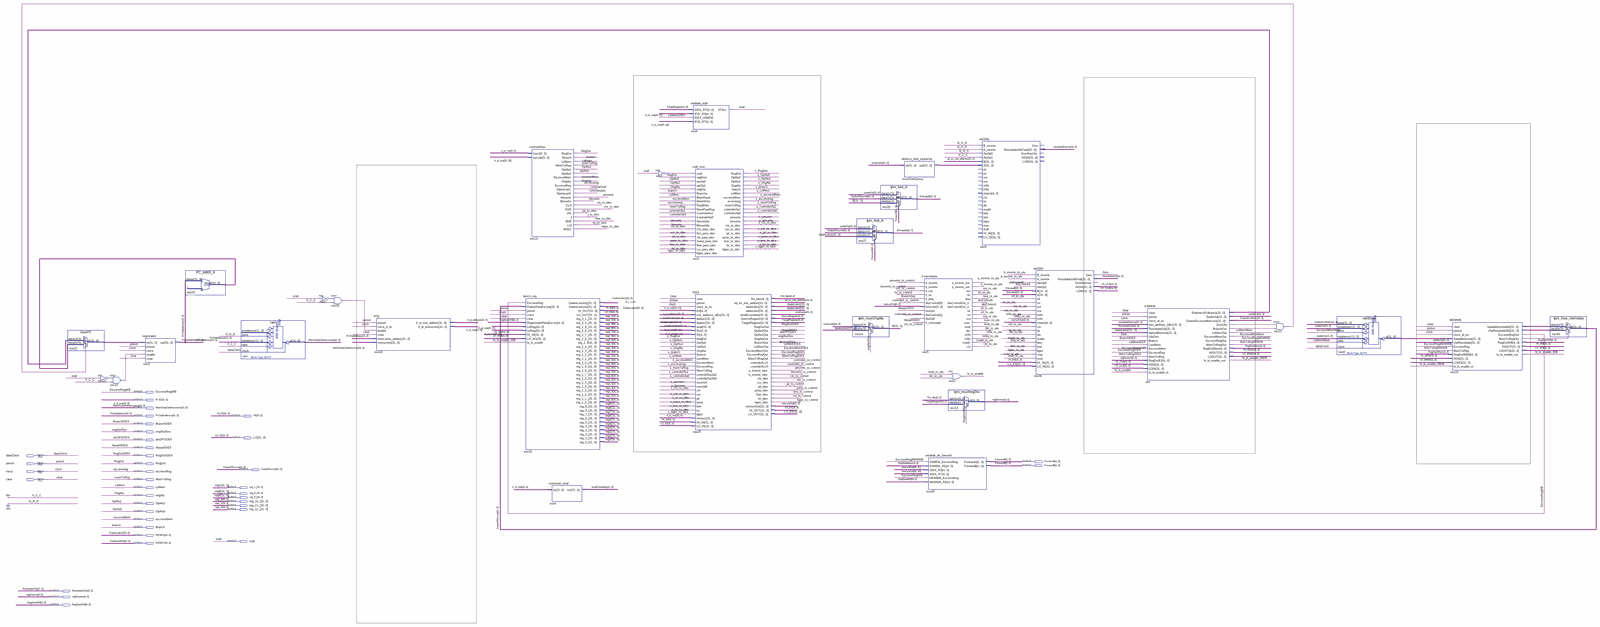
[diagram p0: schematic sheet, whole]
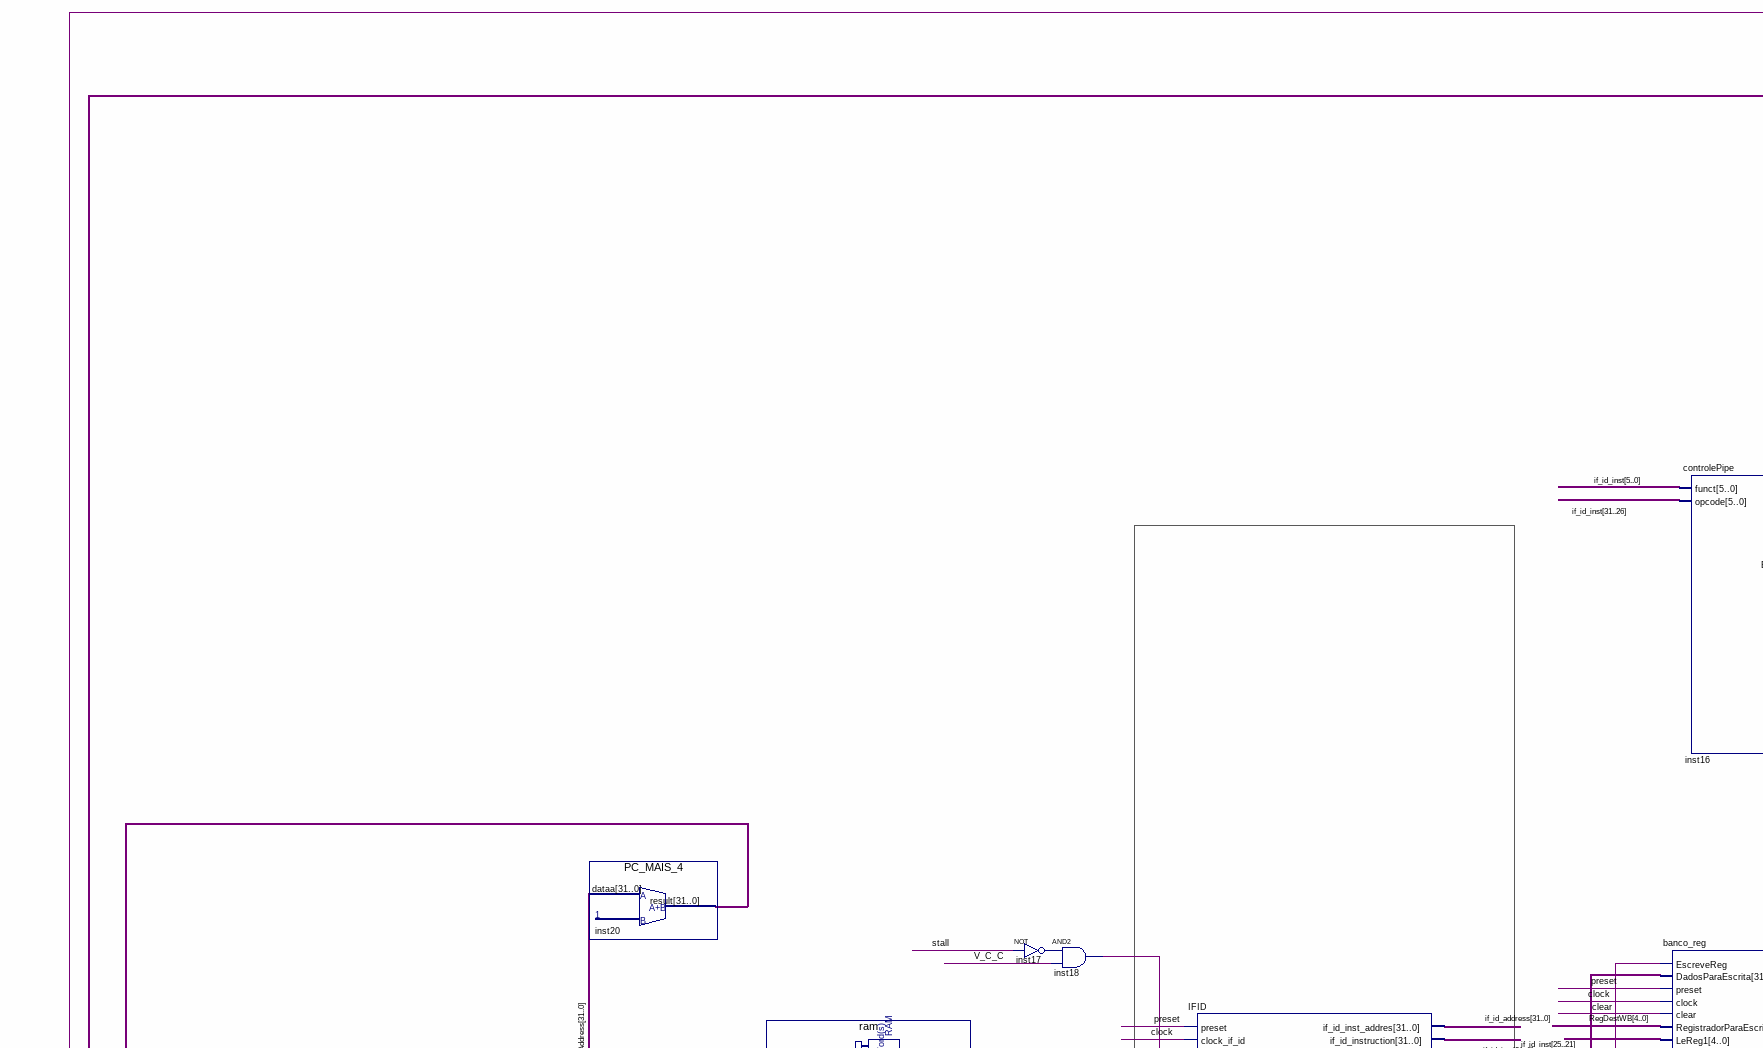
[diagram p1: schematic sheet, upper left part]
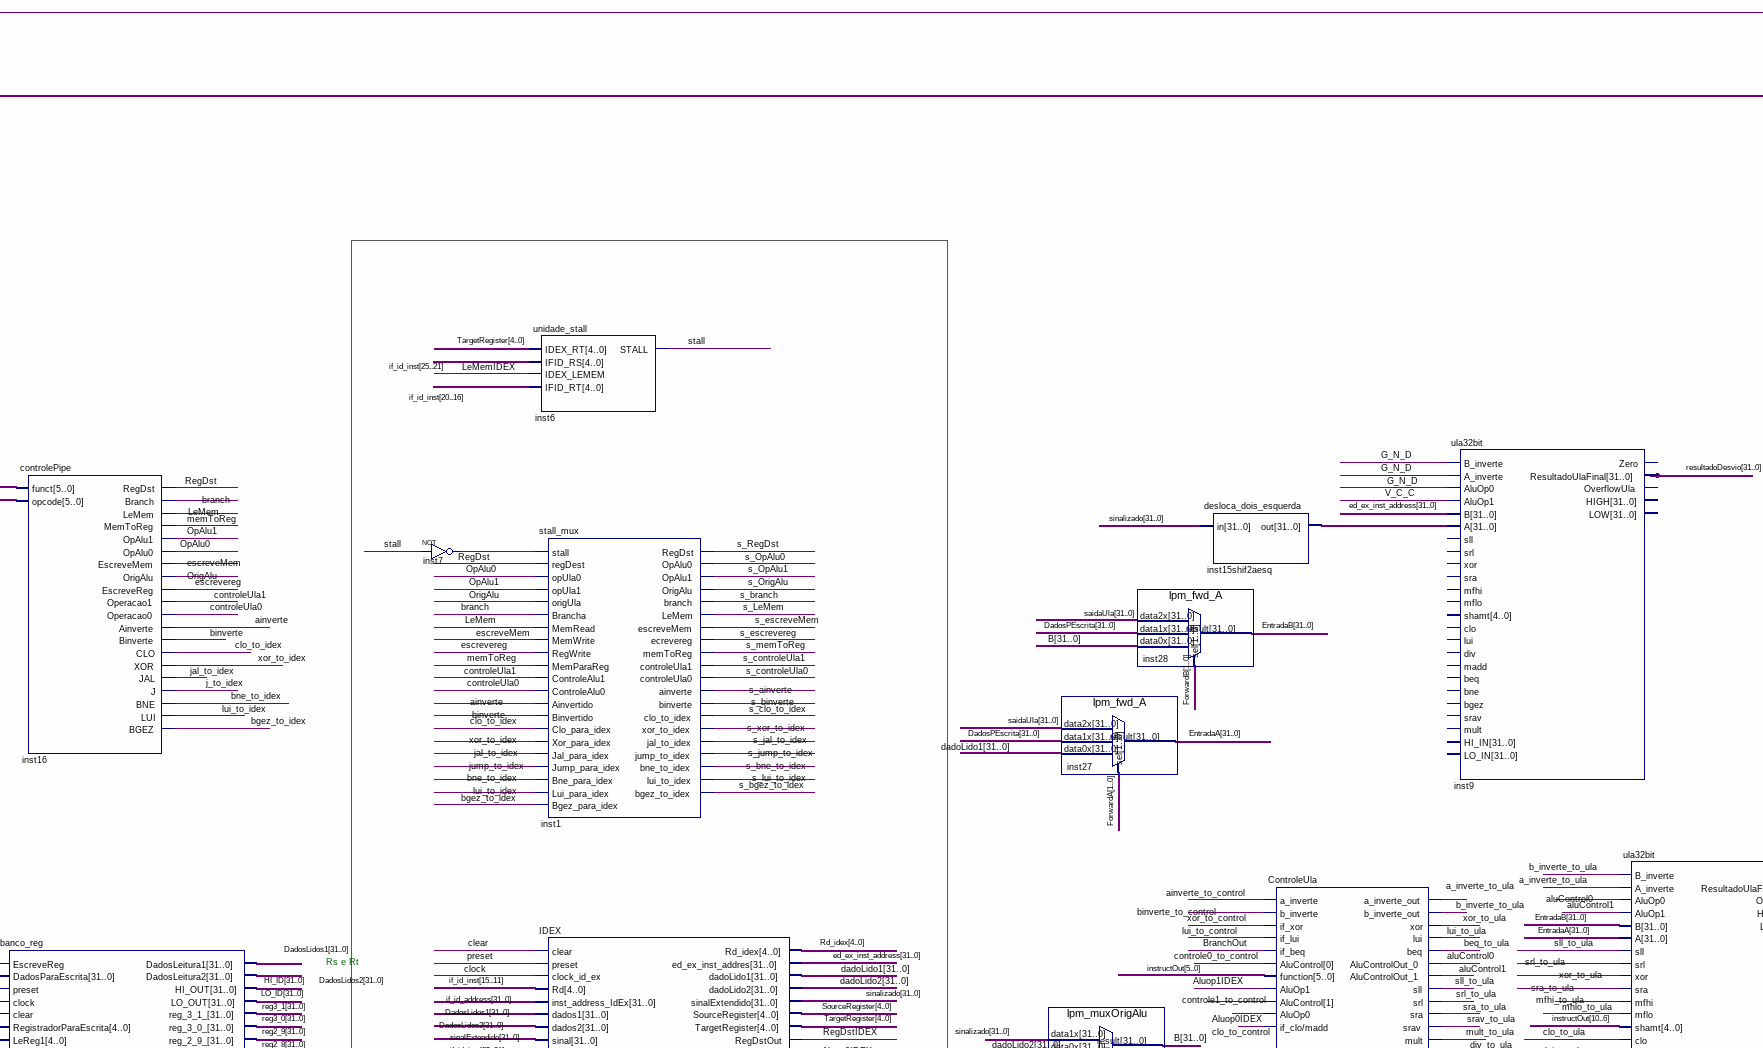
[diagram p2: schematic sheet, upper centre part]
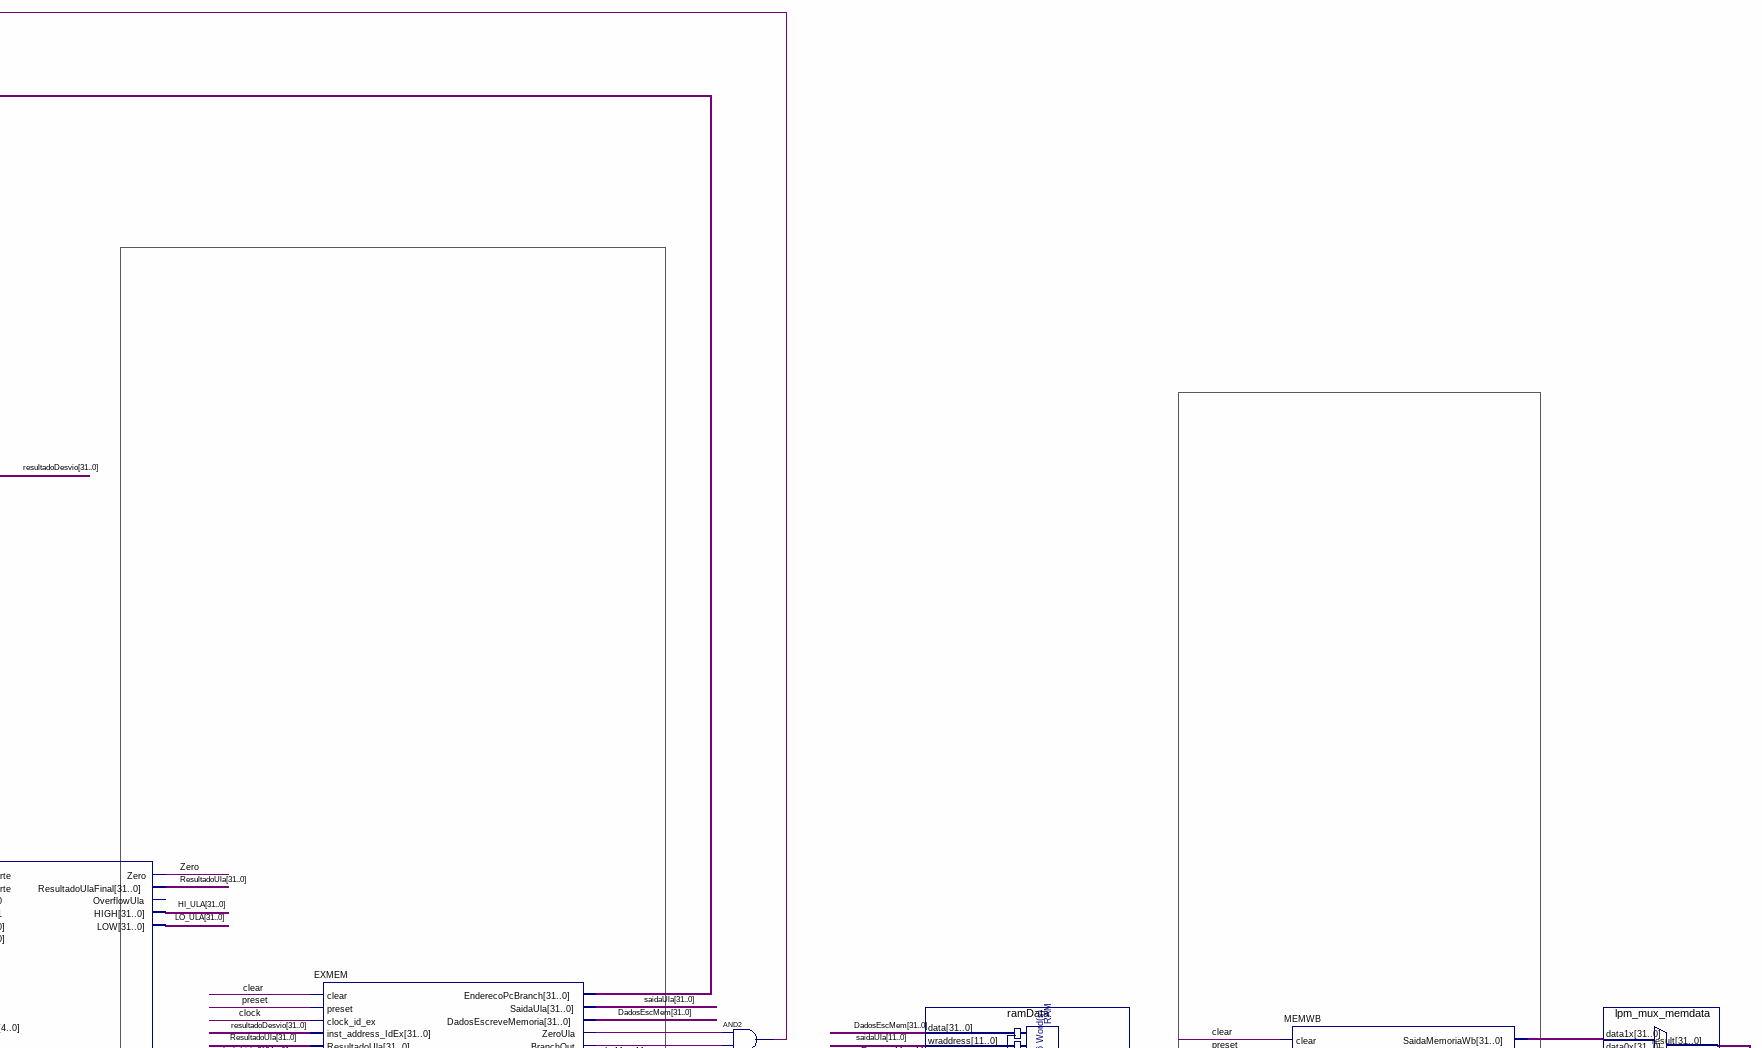
[diagram p3: schematic sheet, upper right part]
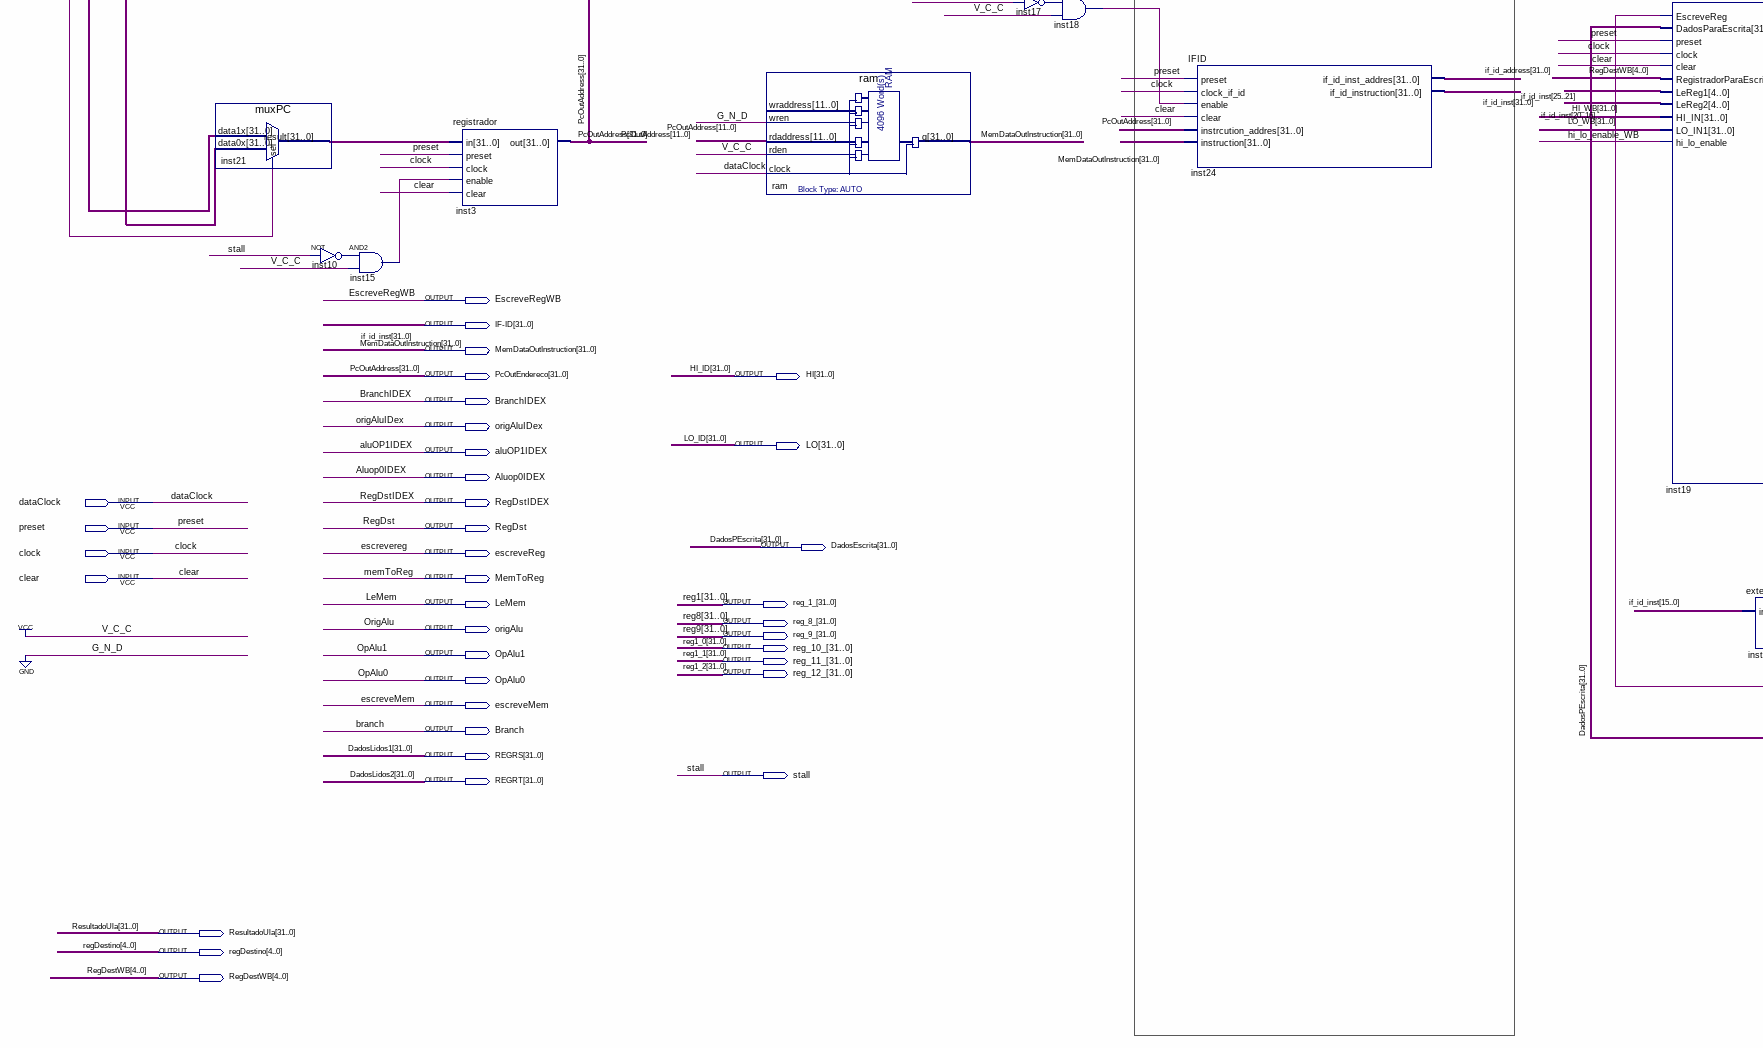
[diagram p4: schematic sheet, lower left part]
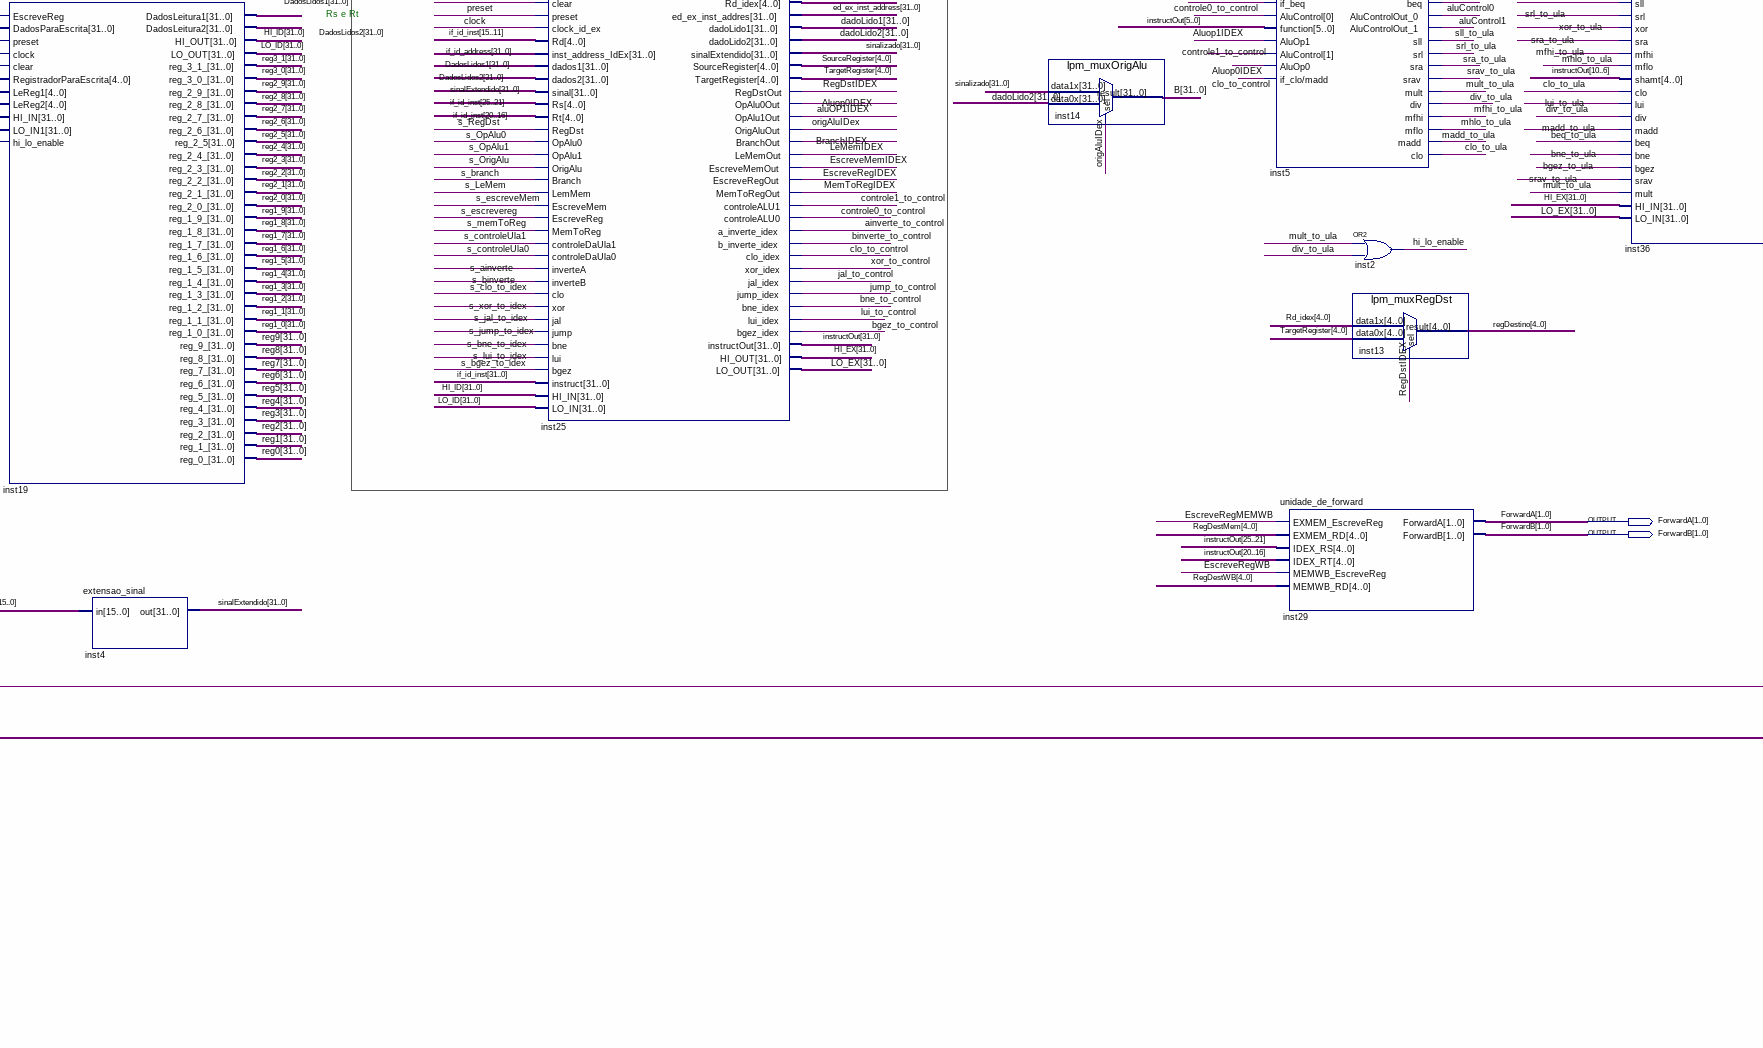
[diagram p5: schematic sheet, lower centre part]
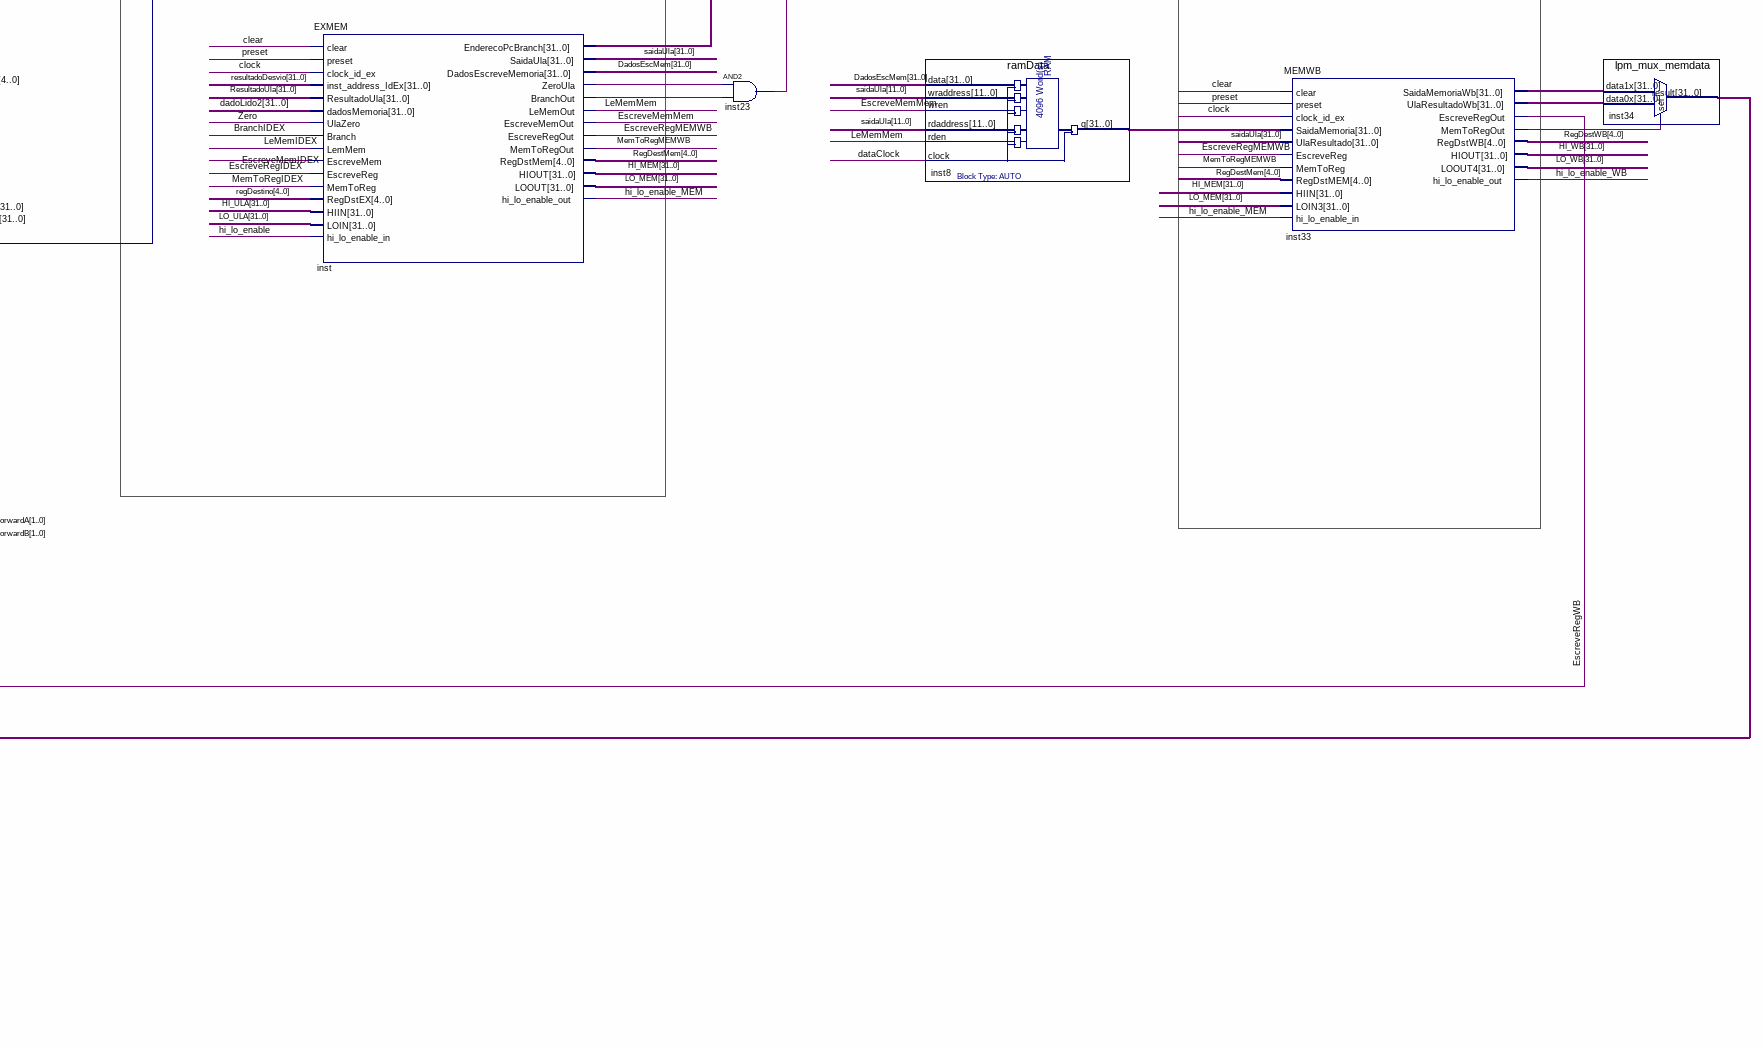
[diagram p6: schematic sheet, lower right part]
// Quartus schematic MipsProcessador.bdf as structural Verilog: 31 symbols, 39 pins
module MipsProcessador (
  input  dataClock,
  input  preset,
  input  clock,
  input  clear,
  output EscreveRegWB,
  output [31:0] \IF-ID ,
  output [31:0] MemDataOutInstruction,
  output [31:0] PcOutEndereco,
  output [31:0] HI,
  output BranchIDEX,
  output origAluIDex,
  output [31:0] LO,
  output aluOP1IDEX,
  output Aluop0IDEX,
  output RegDstIDEX,
  output [1:0] ForwardA,
  output RegDst,
  output [1:0] ForwardB,
  output [31:0] DadosEscrita,
  output escreveReg,
  output MemToReg,
  output LeMem,
  output [31:0] reg_1_,
  output [31:0] reg_8_,
  output origAlu,
  output [31:0] reg_9_,
  output [31:0] reg_10_,
  output OpAlu1,
  output [31:0] reg_11_,
  output [31:0] reg_12_,
  output OpAlu0,
  output escreveMem,
  output Branch,
  output [31:0] REGRS,
  output stall,
  output [31:0] REGRT,
  output [31:0] ResultadoUla,
  output [4:0] regDestino,
  output [4:0] RegDestWB
);

  wire a_inverte_to_ula, ainverte, ainverte_to_control, aluControl0, aluControl1, b_inverte_to_ula,
       beq_to_ula, bgez_to_control, bgez_to_idex, bgez_to_ula, binverte, binverte_to_control, bne_to_control,
       bne_to_idex, bne_to_ula, BranchOut, clo_to_control, clo_to_idex, clo_to_ula, controle0_to_control,
       controle1_to_control, controleUla0, controleUla1, div_to_ula, EscreveMemIDEX, EscreveMemMem,
       EscreveRegIDEX, EscreveRegMEMWB, hi_lo_enable, hi_lo_enable_MEM, hi_lo_enable_WB, inst7_out,
       inst10_out, inst15_out, inst17_out, inst18_out, inst23_out, inst33_memtoregout, inst_branchout,
       inst_zeroula, j_to_idex, jal_to_control, jal_to_idex, jump_to_control, jump_to_idex, LeMemIDEX,
       LeMemMem, lui_to_control, lui_to_idex, lui_to_ula, madd_to_ula, MemToRegIDEX, MemToRegMEMWB,
       mfhi_to_ula, mhlo_to_ula, mult_to_ula, s_ainverte, s_bgez_to_idex, s_binverte, s_bne_to_idex,
       s_branch, s_clo_to_idex, s_controleUla0, s_controleUla1, s_escreveMem, s_escrevereg, s_jal_to_idex,
       s_jump_to_idex, s_LeMem, s_lui_to_idex, s_memToReg, s_OpAlu0, s_OpAlu1, s_OrigAlu, s_RegDst,
       s_xor_to_idex, sll_to_ula, sra_to_ula, srav_to_ula, srl_to_ula, xor_to_control, xor_to_idex,
       xor_to_ula, Zero;
  wire [4:0] Rd_idex, RegDestMem, SourceRegister, TargetRegister;
  wire [31:0] B, dadoLido1, dadoLido2, DadosEscMem, ed_ex_inst_address, EntradaA, EntradaB, HI_EX, HI_MEM,
       HI_ULA, HI_WB, if_id_address, inst8_q, inst15shif2aesq_out, inst20_result, inst21_result,
       inst33_saidamemoriawb, inst33_ularesultadowb, inst_enderecopcbranch, instructOut, LO_EX, LO_MEM,
       LO_ULA, LO_WB, reg0, reg1_3, reg1_4, reg1_5, reg1_6, reg1_7, reg1_8, reg1_9, reg2, reg2_0, reg2_1,
       reg2_2, reg2_3, reg2_4, reg2_5, reg2_6, reg2_7, reg2_8, reg2_9, reg3, reg3_0, reg3_1, reg4, reg5,
       reg6, reg7, resultadoDesvio, saidaUla, sinalExtendido, sinalizado;

  muxPC inst21 (.data1x(inst_enderecopcbranch), .data0x(inst20_result), .sel(inst23_out), .result(inst21_result));
  not inst10 (inst10_out, stall);
  and inst15 (inst15_out, inst10_out, 1'b1);
  registrador inst3 (
    .in(inst21_result), .preset(preset), .clock(clock), .enable(inst15_out), .clear(clear),
    .out(PcOutEndereco));
  PC_MAIS_4 inst20 (.dataa(PcOutEndereco), .result(inst20_result));
  ram ram (
    .wren(1'b0), .rdaddress(PcOutEndereco[11:0]), .rden(1'b1), .clock(dataClock), .q(MemDataOutInstruction));  // open: wraddress
  not inst17 (inst17_out, stall);
  and inst18 (inst18_out, inst17_out, 1'b1);
  IFID inst24 (
    .preset(preset), .clock_if_id(clock), .enable(inst18_out), .clear(clear),
    .instrcution_addres(PcOutEndereco), .instruction(MemDataOutInstruction),
    .if_id_inst_addres(if_id_address), .if_id_instruction(\IF-ID ));
  controlePipe inst16 (
    .funct(\IF-ID [5:0]), .opcode(\IF-ID [31:26]), .RegDst(RegDst), .Branch(Branch), .LeMem(LeMem),
    .MemToReg(MemToReg), .OpAlu1(OpAlu1), .OpAlu0(OpAlu0), .EscreveMem(escreveMem), .OrigAlu(origAlu),
    .EscreveReg(escreveReg), .Operacao1(controleUla1), .Operacao0(controleUla0), .Ainverte(ainverte),
    .Binverte(binverte), .CLO(clo_to_idex), .XOR(xor_to_idex), .JAL(jal_to_idex), .J(j_to_idex),
    .BNE(bne_to_idex), .LUI(lui_to_idex), .BGEZ(bgez_to_idex));
  banco_reg inst19 (
    .EscreveReg(EscreveRegWB), .DadosParaEscrita(DadosEscrita), .preset(preset), .clock(clock),
    .clear(clear), .RegistradorParaEscrita(RegDestWB), .LeReg1(\IF-ID [25:21]), .LeReg2(\IF-ID [20:16]),
    .HI_IN(HI_WB), .LO_IN1(LO_WB), .hi_lo_enable(hi_lo_enable_WB), .DadosLeitura1(REGRS),
    .DadosLeitura2(REGRT), .HI_OUT(HI), .LO_OUT(LO), .reg_3_1_(reg3_1), .reg_3_0_(reg3_0), .reg_2_9_(reg2_9),
    .reg_2_8_(reg2_8), .reg_2_7_(reg2_7), .reg_2_6_(reg2_6), .reg_2_5(reg2_5), .reg_2_4_(reg2_4),
    .reg_2_3_(reg2_3), .reg_2_2_(reg2_2), .reg_2_1_(reg2_1), .reg_2_0_(reg2_0), .reg_1_9_(reg1_9),
    .reg_1_8_(reg1_8), .reg_1_7_(reg1_7), .reg_1_6_(reg1_6), .reg_1_5_(reg1_5), .reg_1_4_(reg1_4),
    .reg_1_3_(reg1_3), .reg_1_2_(reg_12_), .reg_1_1_(reg_11_), .reg_1_0_(reg_10_), .reg_9_(reg_9_),
    .reg_8_(reg_8_), .reg_7_(reg7), .reg_6_(reg6), .reg_5_(reg5), .reg_4_(reg4), .reg_3_(reg3),
    .reg_2_(reg2), .reg_1_(reg_1_), .reg_0_(reg0));
  extensao_sinal inst4 (.in(\IF-ID [15:0]), .out(sinalExtendido));
  not inst7 (inst7_out, stall);
  unidade_stall inst6 (
    .IDEX_RT(TargetRegister), .IFID_RS(\IF-ID [25:21]), .IDEX_LEMEM(LeMemIDEX), .IFID_RT(\IF-ID [20:16]),
    .STALL(stall));
  stall_mux inst1 (
    .stall(inst7_out), .regDest(RegDst), .opUla0(OpAlu0), .opUla1(OpAlu1), .origUla(origAlu),
    .Brancha(Branch), .MemRead(LeMem), .MemWrite(escreveMem), .RegWrite(escreveReg), .MemParaReg(MemToReg),
    .ControleAlu1(controleUla1), .ControleAlu0(controleUla0), .Ainvertido(ainverte), .Binvertido(binverte),
    .Clo_para_idex(clo_to_idex), .Xor_para_idex(xor_to_idex), .Jal_para_idex(jal_to_idex),
    .Jump_para_idex(jump_to_idex), .Bne_para_idex(bne_to_idex), .Lui_para_idex(lui_to_idex),
    .Bgez_para_idex(bgez_to_idex), .RegDst(s_RegDst), .OpAlu0(s_OpAlu0), .OpAlu1(s_OpAlu1),
    .OrigAlu(s_OrigAlu), .branch(s_branch), .LeMem(s_LeMem), .escreveMem(s_escreveMem),
    .ecrevereg(s_escrevereg), .memToReg(s_memToReg), .controleUla1(s_controleUla1),
    .controleUla0(s_controleUla0), .ainverte(s_ainverte), .binverte(s_binverte), .clo_to_idex(s_clo_to_idex),
    .xor_to_idex(s_xor_to_idex), .jal_to_idex(s_jal_to_idex), .jump_to_idex(s_jump_to_idex),
    .bne_to_idex(s_bne_to_idex), .lui_to_idex(s_lui_to_idex), .bgez_to_idex(s_bgez_to_idex));
  IDEX inst25 (
    .clear(clear), .preset(preset), .clock_id_ex(clock), .Rd(\IF-ID [15:11]),
    .inst_address_IdEx(if_id_address), .dados1(REGRS), .dados2(REGRT), .sinal(sinalExtendido),
    .Rs(\IF-ID [25:21]), .Rt(\IF-ID [20:16]), .RegDst(s_RegDst), .OpAlu0(s_OpAlu0), .OpAlu1(s_OpAlu1),
    .OrigAlu(s_OrigAlu), .Branch(s_branch), .LemMem(s_LeMem), .EscreveMem(s_escreveMem),
    .EscreveReg(s_escrevereg), .MemToReg(s_memToReg), .controleDaUla1(s_controleUla1),
    .controleDaUla0(s_controleUla0), .inverteA(s_ainverte), .inverteB(s_binverte), .clo(s_clo_to_idex),
    .\xor (s_xor_to_idex), .jal(s_jal_to_idex), .jump(s_jump_to_idex), .bne(s_bne_to_idex),
    .lui(s_lui_to_idex), .bgez(s_bgez_to_idex), .instruct(\IF-ID ), .HI_IN(HI), .LO_IN(LO),
    .Rd_idex(Rd_idex), .ed_ex_inst_addres(ed_ex_inst_address), .dadoLido1(dadoLido1), .dadoLido2(dadoLido2),
    .sinalExtendido(sinalizado), .SourceRegister(SourceRegister), .TargetRegister(TargetRegister),
    .RegDstOut(RegDstIDEX), .OpAlu0Out(Aluop0IDEX), .OpAlu1Out(aluOP1IDEX), .OrigAluOut(origAluIDex),
    .BranchOut(BranchIDEX), .LeMemOut(LeMemIDEX), .EscreveMemOut(EscreveMemIDEX),
    .EscreveRegOut(EscreveRegIDEX), .MemToRegOut(MemToRegIDEX), .controleALU1(controle1_to_control),
    .controleALU0(controle0_to_control), .a_inverte_idex(ainverte_to_control),
    .b_inverte_idex(binverte_to_control), .clo_idex(clo_to_control), .xor_idex(xor_to_control),
    .jal_idex(jal_to_control), .jump_idex(jump_to_control), .bne_idex(bne_to_control),
    .lui_idex(lui_to_control), .bgez_idex(bgez_to_control), .instructOut(instructOut), .HI_OUT(HI_EX),
    .LO_OUT(LO_EX));
  lpm_fwd_A inst27 (.data2x(saidaUla), .data1x(DadosEscrita), .data0x(dadoLido1), .sel(ForwardA), .result(EntradaA));
  lpm_muxOrigAlu inst14 (.data1x(sinalizado), .data0x(dadoLido2), .sel(origAluIDex), .result(B));
  lpm_fwd_A inst28 (.data2x(saidaUla), .data1x(DadosEscrita), .data0x(B), .sel(ForwardB), .result(EntradaB));
  desloca_dois_esquerda inst15shif2aesq (.in(sinalizado), .out(inst15shif2aesq_out));
  ControleUla inst5 (
    .a_inverte(ainverte_to_control), .b_inverte(binverte_to_control), .if_xor(xor_to_control),
    .if_lui(lui_to_control), .if_beq(BranchOut), .AluControl({controle1_to_control, controle0_to_control}),
    .\function (instructOut[5:0]), .AluOp1(aluOP1IDEX), .AluOp0(Aluop0IDEX), .\if_clo/madd (clo_to_control),
    .a_inverte_out(a_inverte_to_ula), .b_inverte_out(b_inverte_to_ula), .\xor (xor_to_ula), .lui(lui_to_ula),
    .beq(beq_to_ula), .AluControlOut_0(aluControl0), .AluControlOut_1(aluControl1), .sll(sll_to_ula),
    .srl(srl_to_ula), .sra(sra_to_ula), .srav(srav_to_ula), .mult(mult_to_ula), .div(div_to_ula),
    .mfhi(mfhi_to_ula), .mflo(mhlo_to_ula), .madd(madd_to_ula), .clo(clo_to_ula));
  unidade_de_forward inst29 (
    .EXMEM_EscreveReg(EscreveRegMEMWB), .EXMEM_RD(RegDestMem), .IDEX_RS(instructOut[25:21]),
    .IDEX_RT(instructOut[20:16]), .MEMWB_EscreveReg(EscreveRegWB), .MEMWB_RD(RegDestWB), .ForwardA(ForwardA),
    .ForwardB(ForwardB));
  or inst2 (hi_lo_enable, mult_to_ula, div_to_ula);
  lpm_muxRegDst inst13 (.data1x(Rd_idex), .data0x(TargetRegister), .sel(RegDstIDEX), .result(regDestino));
  ula32bit inst9 (
    .B_inverte(1'b0), .A_inverte(1'b0), .AluOp0(1'b0), .AluOp1(1'b1), .B(ed_ex_inst_address),
    .A(inst15shif2aesq_out), .ResultadoUlaFinal(resultadoDesvio));  // open: sll, srl, xor, sra, mfhi, mflo, shamt, clo, lui, div, madd, beq, bne, bgez, srav, mult, HI_IN, LO_IN, Zero, OverflowUla, HIGH, LOW
  ula32bit inst36 (
    .B_inverte(b_inverte_to_ula), .A_inverte(a_inverte_to_ula), .AluOp0(aluControl0), .AluOp1(aluControl1),
    .B(EntradaB), .A(EntradaA), .sll(sll_to_ula), .srl(srl_to_ula), .\xor (xor_to_ula), .sra(sra_to_ula),
    .mfhi(mfhi_to_ula), .mflo(mhlo_to_ula), .shamt(instructOut[10:6]), .clo(clo_to_ula), .lui(lui_to_ula),
    .div(div_to_ula), .madd(madd_to_ula), .beq(beq_to_ula), .bne(bne_to_ula), .bgez(bgez_to_ula),
    .srav(srav_to_ula), .mult(mult_to_ula), .HI_IN(HI_EX), .LO_IN(LO_EX), .Zero(Zero),
    .ResultadoUlaFinal(ResultadoUla), .HIGH(HI_ULA), .LOW(LO_ULA));  // open: OverflowUla
  EXMEM inst (
    .clear(clear), .preset(preset), .clock_id_ex(clock), .inst_address_IdEx(resultadoDesvio),
    .ResultadoUla(ResultadoUla), .dadosMemoria(dadoLido2), .UlaZero(Zero), .Branch(BranchIDEX),
    .LemMem(LeMemIDEX), .EscreveMem(EscreveMemIDEX), .EscreveReg(EscreveRegIDEX), .MemToReg(MemToRegIDEX),
    .RegDstEX(regDestino), .HIIN(HI_ULA), .LOIN(LO_ULA), .hi_lo_enable_in(hi_lo_enable),
    .EnderecoPcBranch(inst_enderecopcbranch), .SaidaUla(saidaUla), .DadosEscreveMemoria(DadosEscMem),
    .ZeroUla(inst_zeroula), .BranchOut(inst_branchout), .LeMemOut(LeMemMem), .EscreveMemOut(EscreveMemMem),
    .EscreveRegOut(EscreveRegMEMWB), .MemToRegOut(MemToRegMEMWB), .RegDstMem(RegDestMem), .HIOUT(HI_MEM),
    .LOOUT(LO_MEM), .hi_lo_enable_out(hi_lo_enable_MEM));
  and inst23 (inst23_out, inst_zeroula, inst_branchout);
  ramData inst8 (
    .data(DadosEscMem), .wraddress(saidaUla[11:0]), .wren(EscreveMemMem), .rdaddress(saidaUla[11:0]),
    .rden(LeMemMem), .clock(dataClock), .q(inst8_q));
  MEMWB inst33 (
    .clear(clear), .preset(preset), .clock_id_ex(clock), .SaidaMemoria(inst8_q), .UlaResultado(saidaUla),
    .EscreveReg(EscreveRegMEMWB), .MemToReg(MemToRegMEMWB), .RegDstMEM(RegDestMem), .HIIN(HI_MEM),
    .LOIN3(LO_MEM), .hi_lo_enable_in(hi_lo_enable_MEM), .SaidaMemoriaWb(inst33_saidamemoriawb),
    .UlaResultadoWb(inst33_ularesultadowb), .EscreveRegOut(EscreveRegWB), .MemToRegOut(inst33_memtoregout),
    .RegDstWB(RegDestWB), .HIOUT(HI_WB), .LOOUT4(LO_WB), .hi_lo_enable_out(hi_lo_enable_WB));
  lpm_mux_memdata inst34 (
    .data1x(inst33_saidamemoriawb), .data0x(inst33_ularesultadowb), .sel(inst33_memtoregout),
    .result(DadosEscrita));

  // Other names for the same wires on the sheet: DadosLidos1[31:0] = REGRS; DadosLidos2[31:0] = REGRT;
  //   DadosPEscrita[31:0] = DadosEscrita; HI_ID[31:0] = HI; if_id_inst[31:0] = \IF-ID ; LO_ID[31:0] = LO;
  //   PcOutAddress[31:0] = PcOutEndereco; reg1[31:0] = reg_1_; reg1_0[31:0] = reg_10_; reg1_1[31:0] = reg_11_;
  //   reg1_2[31:0] = reg_12_; reg8[31:0] = reg_8_; reg9[31:0] = reg_9_

  // Notes on the sheet:
  //   Rs e Rt
endmodule
